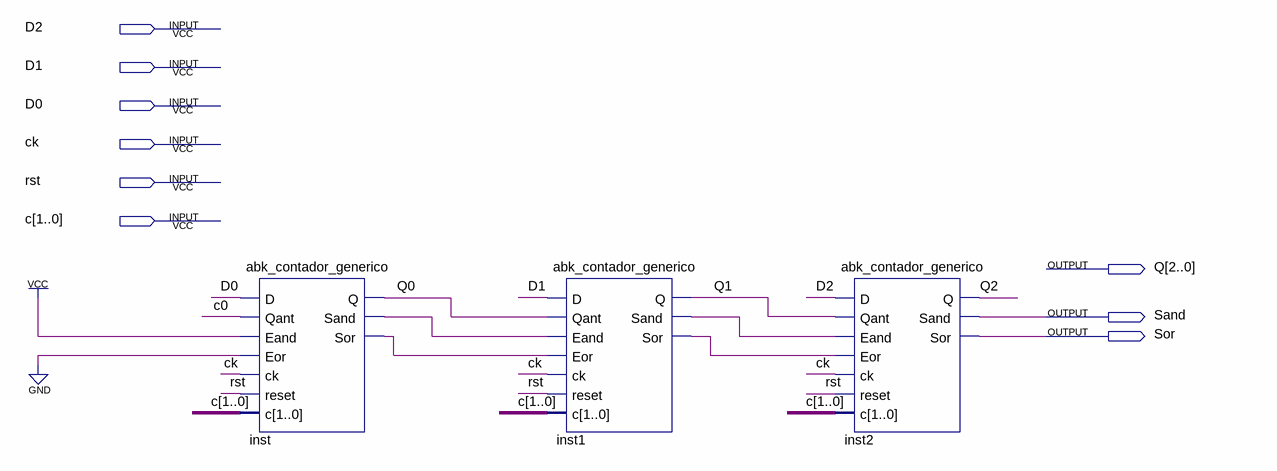
[diagram p0: schematic sheet]
// Quartus schematic abk_contador3bits.bdf as structural Verilog: 3 symbols, 9 pins
module abk_contador3bits (
  input  D2,
  input  D1,
  input  D0,
  input  ck,
  input  rst,
  input  [1:0] c,
  output [2:0] Q,
  output Sand,
  output Sor
);

  wire inst1_sand, inst1_sor, inst_sand, inst_sor;

  abk_contador_generico inst (
    .D(D0), .Qant(c[0]), .Eand(1'b1), .Eor(1'b0), .ck(ck), .reset(rst), .c(c), .Q(Q[0]), .Sand(inst_sand),
    .Sor(inst_sor));
  abk_contador_generico inst1 (
    .D(D1), .Qant(Q[0]), .Eand(inst_sand), .Eor(inst_sor), .ck(ck), .reset(rst), .c(c), .Q(Q[1]),
    .Sand(inst1_sand), .Sor(inst1_sor));
  abk_contador_generico inst2 (
    .D(D2), .Qant(Q[1]), .Eand(inst1_sand), .Eor(inst1_sor), .ck(ck), .reset(rst), .c(c), .Q(Q[2]),
    .Sand(Sand), .Sor(Sor));
endmodule
